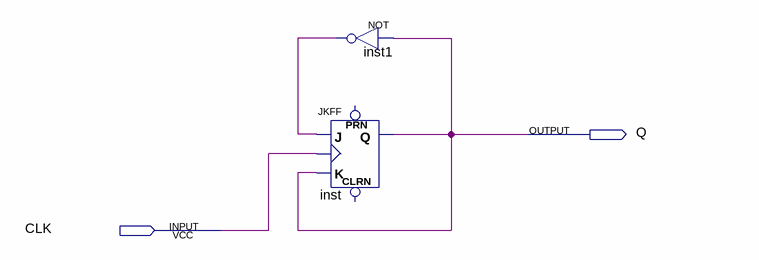
[diagram p0: schematic sheet]
// Quartus schematic DoubleClock.bdf as structural Verilog: 2 symbols, 2 pins
module DoubleClock (
  input  CLK,
  output Q
);

  wire inst1_out;

  JKFF inst (.K(Q), .J(inst1_out), .CLK(CLK), .Q(Q));  // open: PRN, CLRN
  not inst1 (inst1_out, Q);
endmodule
